# EAGLE design SPI RPM Sensor (EAGLE 7.1.0)
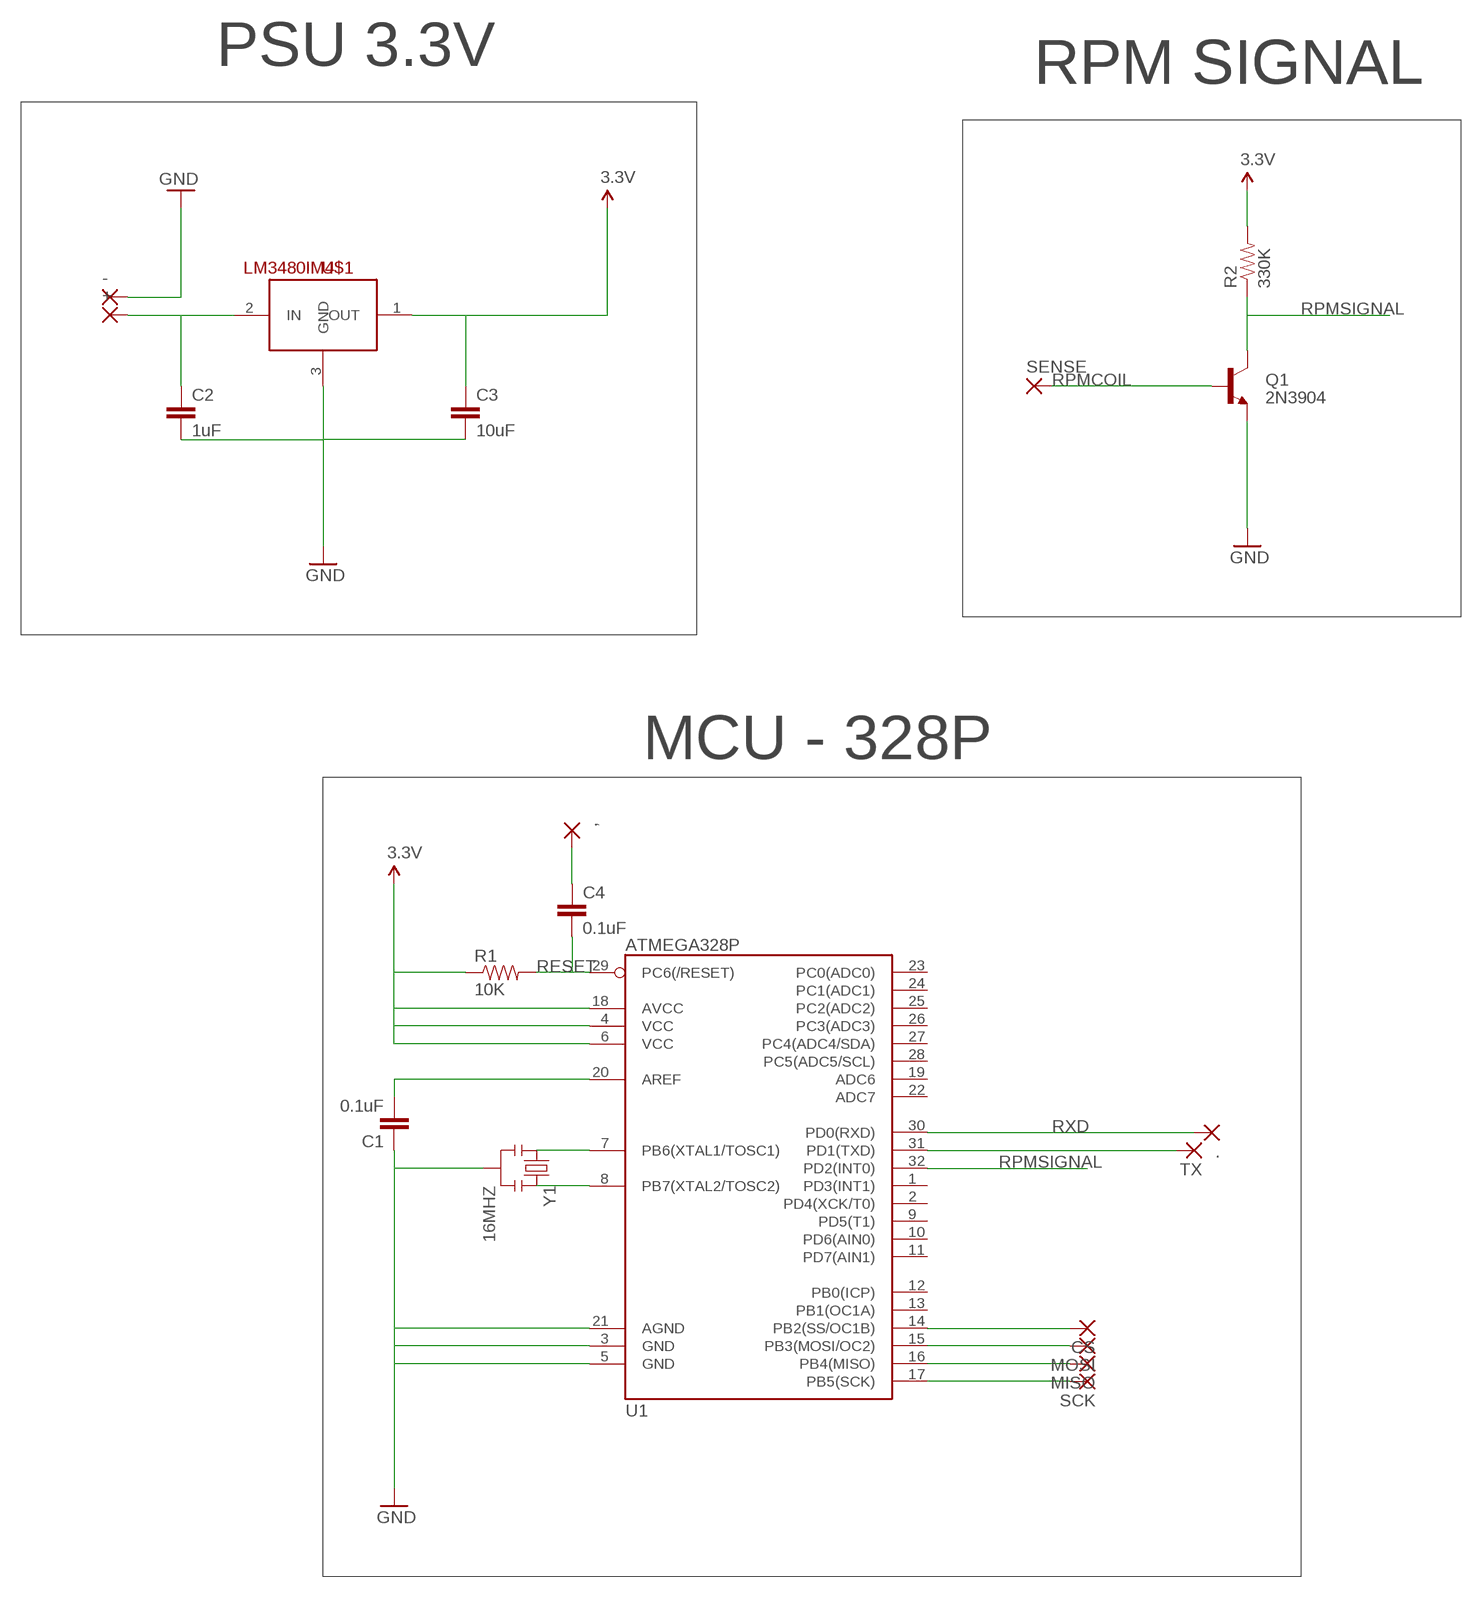
[diagram p0: schematic, sheet 1]

## Parts
+  WIREPADSMD5-2,5  [5-2,5]
,  WIREPADSMD1,27-254  [SMD1,27-2,54]
-  WIREPADSMD5-2,5  [5-2,5]
.  WIREPADSMD1,27-254  [SMD1,27-2,54]
C1  0.1uF  CAP0603-CAP  [0603-CAP]
C2  1uF  CAP0603-CAP  [0603-CAP]
C3  10uF  CAP0603-CAP  [0603-CAP]
C4  0.1uF  CAP0603-CAP  [0603-CAP]
CS  WIREPADSMD5-2,5  [5-2,5]
MISO  WIREPADSMD5-2,5  [5-2,5]
MOSI  WIREPADSMD5-2,5  [5-2,5]
Q1  2N3904  TRANSISTOR_NPN2N3904  [TO-92]
R1  10K  RESISTOR0603  [0603-RES]
R2  330K  RESISTOR0603-RES  [0603-RES]
SCK  WIREPADSMD5-2,5  [5-2,5]
SENSE  WIREPADSMD5-2,5  [5-2,5]
TX  WIREPADSMD1,27-254  [SMD1,27-2,54]
U1  ATMEGA328P  ATMEGA328_SMT  [TQFP32-08]
U$1  LM3480IM4  [SOT23-3]
Y1  16MHZ  RESONATOR16MHZ  [RESONATOR-SMD]

## Nets
3.3V: C3.1 R1.1 R2.2 U1.4(VCC) U1.6(VCC) U1.18(AVCC) U$1.1(OUT)
AREF: C1.2 U1.20(AREF)
CS: CS.1(P) U1.14(PB2(SS/OC1B))
GND: -.1(P) C1.1 C2.2 C3.2 Q1.1(E) U1.3(GND) U1.5(GND) U1.21(AGND) U$1.3(GND) Y1.2
MISO: MISO.1(P) U1.16(PB4(MISO))
MOSI: MOSI.1(P) U1.15(PB3(MOSI/OC2))
N$1: U1.7(PB6(XTAL1/TOSC1)) Y1.1
N$2: U1.8(PB7(XTAL2/TOSC2)) Y1.3
N$3: TX.1(P) U1.31(PD1(TXD))
N$4: ,.1(P) C4.1
RESET: C4.2 R1.2 U1.29(PC6(/RESET))
RPMCOIL: Q1.2(B) SENSE.1(P)
RPMSIGNAL: Q1.3(C) R2.1 U1.32(PD2(INT0))
RXD: ..1(P) U1.30(PD0(RXD))
SCK: SCK.1(P) U1.17(PB5(SCK))
VIN: +.1(P) C2.1 U$1.2(IN)
Unconnected: U1.1(PD3(INT1)) U1.2(PD4(XCK/T0)) U1.9(PD5(T1)) U1.10(PD6(AIN0)) U1.11(PD7(AIN1)) U1.12(PB0(ICP)) U1.13(PB1(OC1A)) U1.19(ADC6) U1.22(ADC7) U1.23(PC0(ADC0)) U1.24(PC1(ADC1)) U1.25(PC2(ADC2)) U1.26(PC3(ADC3)) U1.27(PC4(ADC4/SDA)) U1.28(PC5(ADC5/SCL))

## Notes on the sheet
- PSU 3.3V | RPM SIGNAL | RPM SIGNAL
- MCU - 328P

## Library data of the parts
+ , - . CS MISO MOSI SCK SENSE TX = wirepad:WIREPAD: Wire PAD connect wire on PCB
C1 = SparkFun-Passives:CAP: Capacitor Standard 0603 ceramic capacitor, and 0.1" leaded capacitor.
C2-C4 = SparkFun-Capacitors:CAP: Capacitor Standard 0603 ceramic capacitor, and 0.1" leaded capacitor.
Q1 = SparkFun-DiscreteSemi:TRANSISTOR_NPN: Generic NPN BJT MMBT2222A - TRANS-08049 (SOT-23, 1A 40V) MPSA42 - TRANS-09116 (SOT-23, 500mA 300V) MMBT5088LT1G - TRANS-11160 (SOT-23, 50 mA 30V) BC547 - COM-08928 <http://www.sparkfun.com/products/8928> (TO-92 45V 100mA) (1.Collector 2.Base 3.Emitter) 2N3904 - COM-00521 <http://www.sparkfun.com/products/521> (TO-92 40V 200mA) (1.Emitter 2.Base 3.Collector) P2N2222A - COM-12852 <http://www.sparkfun.com/products/12852> (TO-92 40V 600mA) (1.Collector 2.Base 3.Emitter); PROD_ID: TRANS-08447
R1 = SparkFun-Resistors:RESISTOR: Resistor Basic schematic elements and footprints for 0603, 1206, and PTH resistors.
R2 = SparkFun-Passives:RESISTOR: Resistor Basic schematic elements and footprints for 0603, 1206, and PTH resistors.
U1 = SparkFun-DigitalIC:ATMEGA328_SMT: 32-Pin Atmega328 part Commonly used on Arduino compatible boards Available in QFP and QFN packages TQFP is IC-09069 QFN is non-stock; PROD_ID: IC-09069
U$1 = SparkFun-PowerIC:LM3480IM4: Small package linear regulator
Y1 = SparkFun-FreqCtrl:RESONATOR: Resonator Small SMD resonator. Used, eg, on the Arduino Pro/ Pro Mini boards. 8MHz- XTAL-08895 16MHz- XTAL-08900; PROD_ID: XTAL-08900

## Board
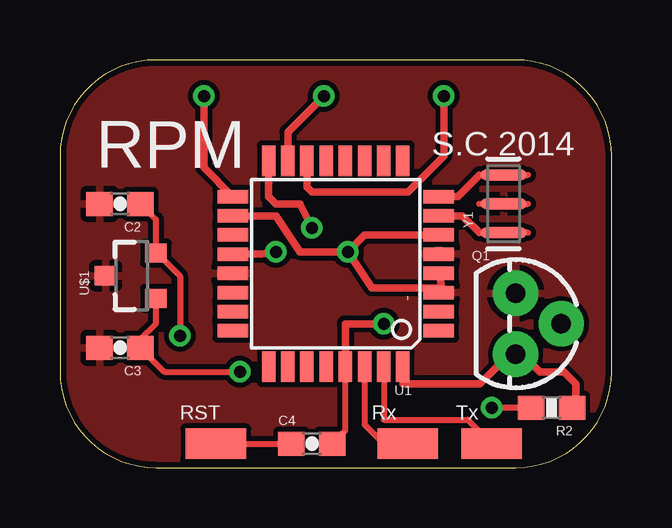
[diagram p1: board, top side]
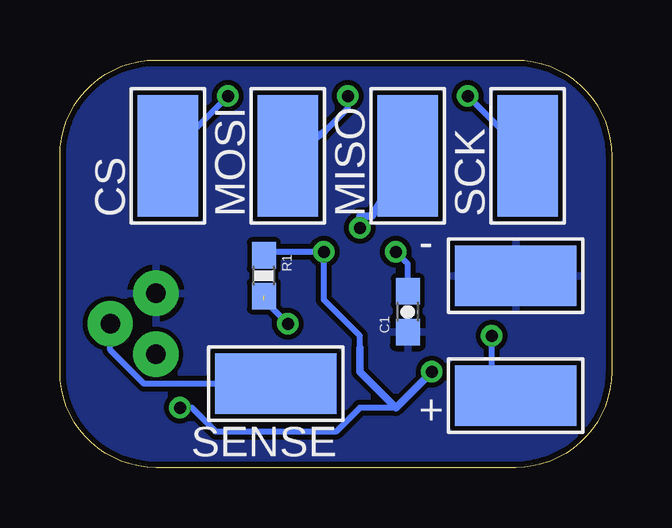
[diagram p2: board, bottom side, seen from below]

Size 23 x 17 mm. Coordinates in mm from the lower left corner, seen from the top.
Outline: 0,13 0,4 arc90 4,0 19,0 arc90 23,4 23,13 arc90 19,17 4,17 arc90 0,13
Copper layers (1*16): Top 0.035mm / dielectric 1.5mm / Bottom 0.035mm
Design rules "default *": minimum track width 10mil, minimum drill 24mil, track to track 8mil, track to pad 8mil, pad to pad 8mil, via to via 8mil, smd to smd 8mil, copper to edge 10mil, drill to drill 8mil, minimum pad ring 10mil, minimum via ring 8mil, stop-mask expansion 4mil, vias tented up to drill 0mil, thermal gap 10mil

### Footprints (pad centres in the part's own frame; a part is rotated, then mirrored left to right if it is on the bottom)
5-2,5 = smd 2.54 x 5.08: 1 0,0
SMD1,27-2,54 = smd 1.27 x 2.54: 1 0,0
0603-CAP = smd 1.1 x 1: 1 -0.85,0; 2 0.85,0
TO-92 = drill 0.813 pad 1.88: 1 -1.27,0; 2 0,1.905; 3 1.27,0
0603-RES = smd 1.1 x 1: 1 -0.85,0; 2 0.85,0
TQFP32-08 = smd 1.27 x 0.559: 1 -4.293,2.8; 2 -4.293,2; 3 -4.293,1.2; 4 -4.293,0.4; 5 -4.293,-0.4; 6 -4.293,-1.2; 7 -4.293,-2; 8 -4.293,-2.8; 17 4.293,-2.8; 18 4.293,-2; 19 4.293,-1.2; 20 4.293,-0.4; 21 4.293,0.4; 22 4.293,1.2; 23 4.293,2; 24 4.293,2.8 | smd 0.559 x 1.27: 9 -2.8,-4.293; 10 -2,-4.293; 11 -1.2,-4.293; 12 -0.4,-4.293; 13 0.4,-4.293; 14 1.2,-4.293; 15 2,-4.293; 16 2.8,-4.293; 25 2.8,4.293; 26 2,4.293; 27 1.2,4.293; 28 0.4,4.293; 29 -0.4,4.293; 30 -1.2,4.293; 31 -2,4.293; 32 -2.8,4.293
SOT23-3 = smd 0.8 x 0.9: 1 -0.95,-1; 2 0.95,-1; 3 0,1.1
RESONATOR-SMD = smd 0.45 x 1.905: 1 -1.2,0; 2 0,0; 3 1.2,0

### Placement (x,y rotation side)
+  4,3 270 bottom
,  6.5,1 90 top
-  4,8 270 bottom
.  14.5,1 90 top
C1  8.5,6.5 90 bottom
C2  2.5,11 180 top
C3  2.5,5 180 top
C4  10.5,1 0 top
CS  18.5,13 0 bottom
MISO  8.5,13 0 bottom
MOSI  13.5,13 0 bottom
Q1  19,6 270 top
R1  14.5,8 270 bottom
R2  20.5,2.5 180 top
SCK  3.5,13 0 bottom
SENSE  14,3.5 90 bottom
TX  18,1 270 top
U1  11.5,8.5 180 top
U$1  3,8 90 top
Y1  18.5,11 90 top

### Tracks (layer width: path | path; a pad name or v marks a point on that pad's centre or on a via)
3.3V  (via drill 0.5 pad 0.25)
  Top 0.254: v7.5,4 4.35,4 C3.1 3.35,5.35 4,6 U$1.1 | R2.2 v18,2.5
  Top 0.305: v12,9 10,9 9,10.5 U1.18 | U1.4 15.9,7.6 15.8,7.5 13,7.5 v12,9 | v12,9 12.7,9.7 U1.6
  Bottom 0.254: 10.5,5 10.5,5.5 12,7 v12,9 14.35,9 R1.1 | 9,2.5 10.5,2.5 11.5,1.5 16.5,1.5 17.5,2.5 v18,2.5
  Bottom 0.305: 10.5,5 10.5,4 9,2.5 v7.5,4
AREF  (via drill 0.5 pad 0.25)
  Top 0.305: U1.20 8.4,8.9 v9,9
  Bottom 0.254: C1.2 8.5,8.5 v9,9
CS  (via drill 0.5 pad 0.25)
  Top 0.305: v16,15.5 16,13 14.5,11.5 10.5,11.5 10.3,11.7 U1.14
  Bottom 0.254: CS.1 v16,15.5
GND
  pour Top: 0,0 23,0 23,17 0,17
  pour Bottom: 0,0 23,0 23,17 0,17
MISO  (via drill 0.5 pad 0.25)
  Top 0.305: U1.16 8.7,11.3 9,11 10,11 v10.5,10
  Bottom 0.305: MISO.1 10,10.5 10.5,10.5 v10.5,10
MOSI  (via drill 0.5 pad 0.25)
  Top 0.305: v11,15.5 9.5,14 U1.15
  Bottom 0.254: 12,14 11,15 v11,15.5
  Bottom 0.305: MOSI.1 12,14
N$1
  Top 0.305: 17.48,9.8 16.78,10.5 U1.7
N$2
  Top 0.305: 17.48,12.2 16.58,11.3 U1.8
N$3
  Top 0.254: U1.31 13.5,2 17,2 TX.1
N$4
  Top 0.254: ,.1 C4.1
RESET  (via drill 0.5 pad 0.25)  (1 unrouted)
  Top 0.254: C4.2 11.9,1.55 U1.29
  Top 0.305: v13.5,6 11.9,6 U1.29
  Bottom 0.254: 14.5,7 v13.5,6
RPMCOIL
  Bottom 0.254: SENSE.1 19.5,3.5 20.91,4.91 Q1.2
RPMSIGNAL
  Top 0.305: R2.1 21.5,2.65 21.5,3.5 21,4 20,4 19,5 | 19,5 17.5,3.5 14.3,3.5 U1.32 | 19,5 Q1.3
RXD
  Top 0.254: U1.30 12.7,1.8 13.5,1 ..1
SCK  (via drill 0.5 pad 0.25)
  Top 0.305: U1.17 6,12.51 v6,15.5
  Bottom 0.254: SCK.1 v6,15.5
  Bottom 0.305: SCK.1 3,12.5
VIN  (via drill 0.5 pad 0.25)
  Top 0.254: 4.95,5.5 v5,5.5 5,8 4.05,8.95 U$1.2 4,10.35 C2.1
  Bottom 0.254: +.1 5,4 v5,5.5

### Text on the board
tNames: S.C 2014 | RPM | RST | Rx | Tx
tTest: Move MCU up, bring resonator closer